# Altium schematic sheet Sheet1.SchDoc
size A2
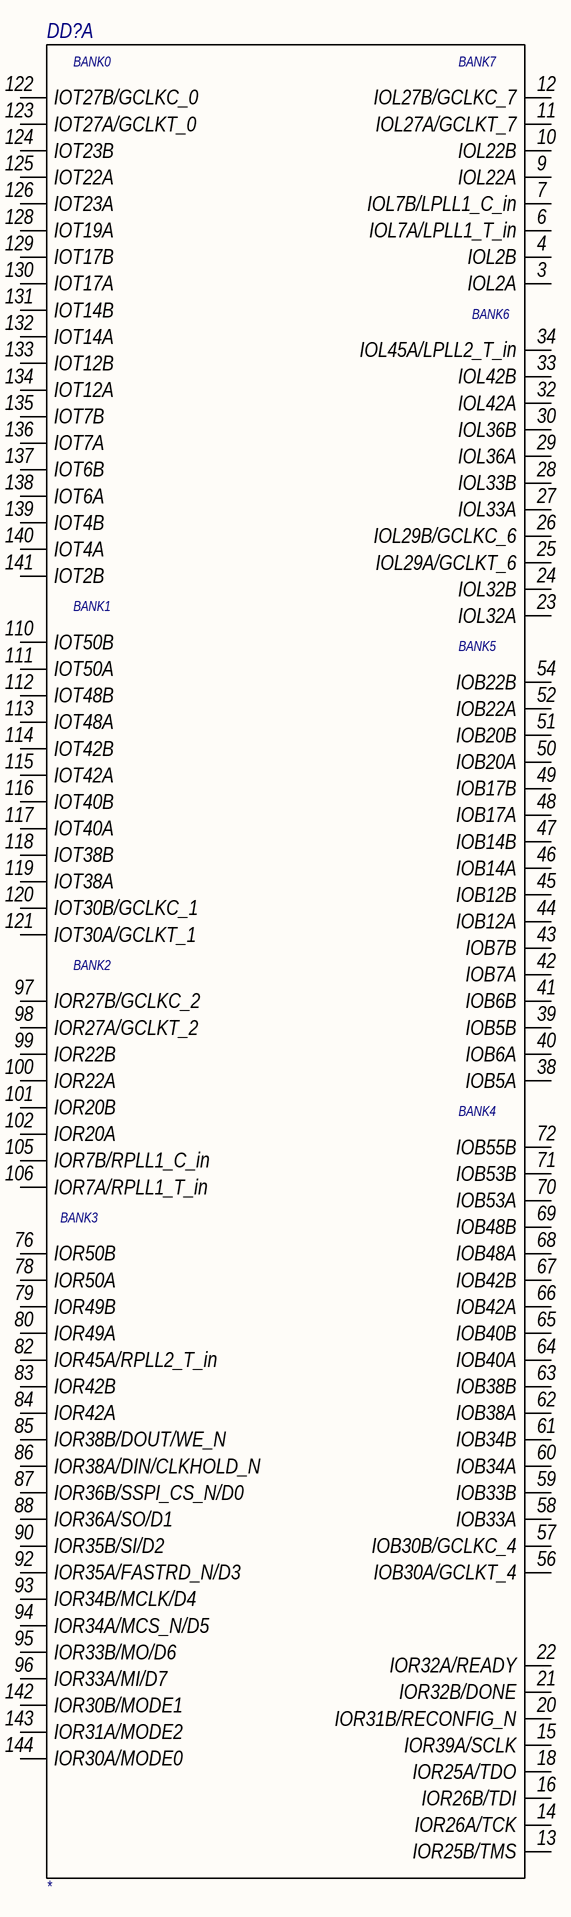
[diagram p0: Sheet1.SchDoc]

## Parts
DD?  D_GW2A-LV18EQ144C8/I7  (value not drawn)  (part A of 2)

## Nets

Not connected (* = marked no-connect by the designer): DD? 3(IOL2A) 4(IOL2B) 6(IOL7A/LPLL1_T_in) 7(IOL7B/LPLL1_C_in) 9(IOL22A) 10(IOL22B) 11(IOL27A/GCLKT_7) 12(IOL27B/GCLKC_7) 13(IOR25B/TMS) 14(IOR26A/TCK) 15(IOR39A/SCLK) 16(IOR26B/TDI) 18(IOR25A/TDO) 20(IOR31B/RECONFIG_N) 21(IOR32B/DONE) 22(IOR32A/READY) 23(IOL32A) 24(IOL32B) 25(IOL29A/GCLKT_6) 26(IOL29B/GCLKC_6) 27(IOL33A) 28(IOL33B) 29(IOL36A) 30(IOL36B) 32(IOL42A) 33(IOL42B) 34(IOL45A/LPLL2_T_in) 38(IOB5A) 39(IOB5B) 40(IOB6A) 41(IOB6B) 42(IOB7A) 43(IOB7B) 44(IOB12A) 45(IOB12B) 46(IOB14A) 47(IOB14B) 48(IOB17A) 49(IOB17B) 50(IOB20A) 51(IOB20B) 52(IOB22A) 54(IOB22B) 56(IOB30A/GCLKT_4) 57(IOB30B/GCLKC_4) 58(IOB33A) 59(IOB33B) 60(IOB34A) 61(IOB34B) 62(IOB38A) 63(IOB38B) 64(IOB40A) 65(IOB40B) 66(IOB42A) 67(IOB42B) 68(IOB48A) 69(IOB48B) 70(IOB53A) 71(IOB53B) 72(IOB55B) 76(IOR50B) 78(IOR50A) 79(IOR49B) 80(IOR49A) 82(IOR45A/RPLL2_T_in) 83(IOR42B) 84(IOR42A) 85(IOR38B/DOUT/WE_N) 86(IOR38A/DIN/CLKHOLD_N) 87(IOR36B/SSPI_CS_N/D0) 88(IOR36A/SO/D1) 90(IOR35B/SI/D2) 92(IOR35A/FASTRD_N/D3) 93(IOR34B/MCLK/D4) 94(IOR34A/MCS_N/D5) 95(IOR33B/MO/D6) 96(IOR33A/MI/D7) 97(IOR27B/GCLKC_2) 98(IOR27A/GCLKT_2) 99(IOR22B) 100(IOR22A) 101(IOR20B) 102(IOR20A) 105(IOR7B/RPLL1_C_in) 106(IOR7A/RPLL1_T_in) 110(IOT50B) 111(IOT50A) 112(IOT48B) 113(IOT48A) 114(IOT42B) 115(IOT42A) 116(IOT40B) 117(IOT40A) 118(IOT38B) 119(IOT38A) 120(IOT30B/GCLKC_1) 121(IOT30A/GCLKT_1) 122(IOT27B/GCLKC_0) 123(IOT27A/GCLKT_0) 124(IOT23B) 125(IOT22A) 126(IOT23A) 128(IOT19A) 129(IOT17B) 130(IOT17A) 131(IOT14B) 132(IOT14A) 133(IOT12B) 134(IOT12A) 135(IOT7B) 136(IOT7A) 137(IOT6B) 138(IOT6A) 139(IOT4B) 140(IOT4A) 141(IOT2B) 142(IOR30B/MODE1) 143(IOR31A/MODE2) 144(IOR30A/MODE0)

## Notes on the sheet
- (in symbol D_GW2A-LV18EQ144C8/I7, part A) BANK0; BANK7; BANK6; BANK1; BANK5; BANK2; BANK4; BANK3

## Library data of the parts
DD? = D_GW2A-LV18EQ144C8/I7: MPN: *